# EAGLE design PiHatMotorController (EAGLE 9.6.0)
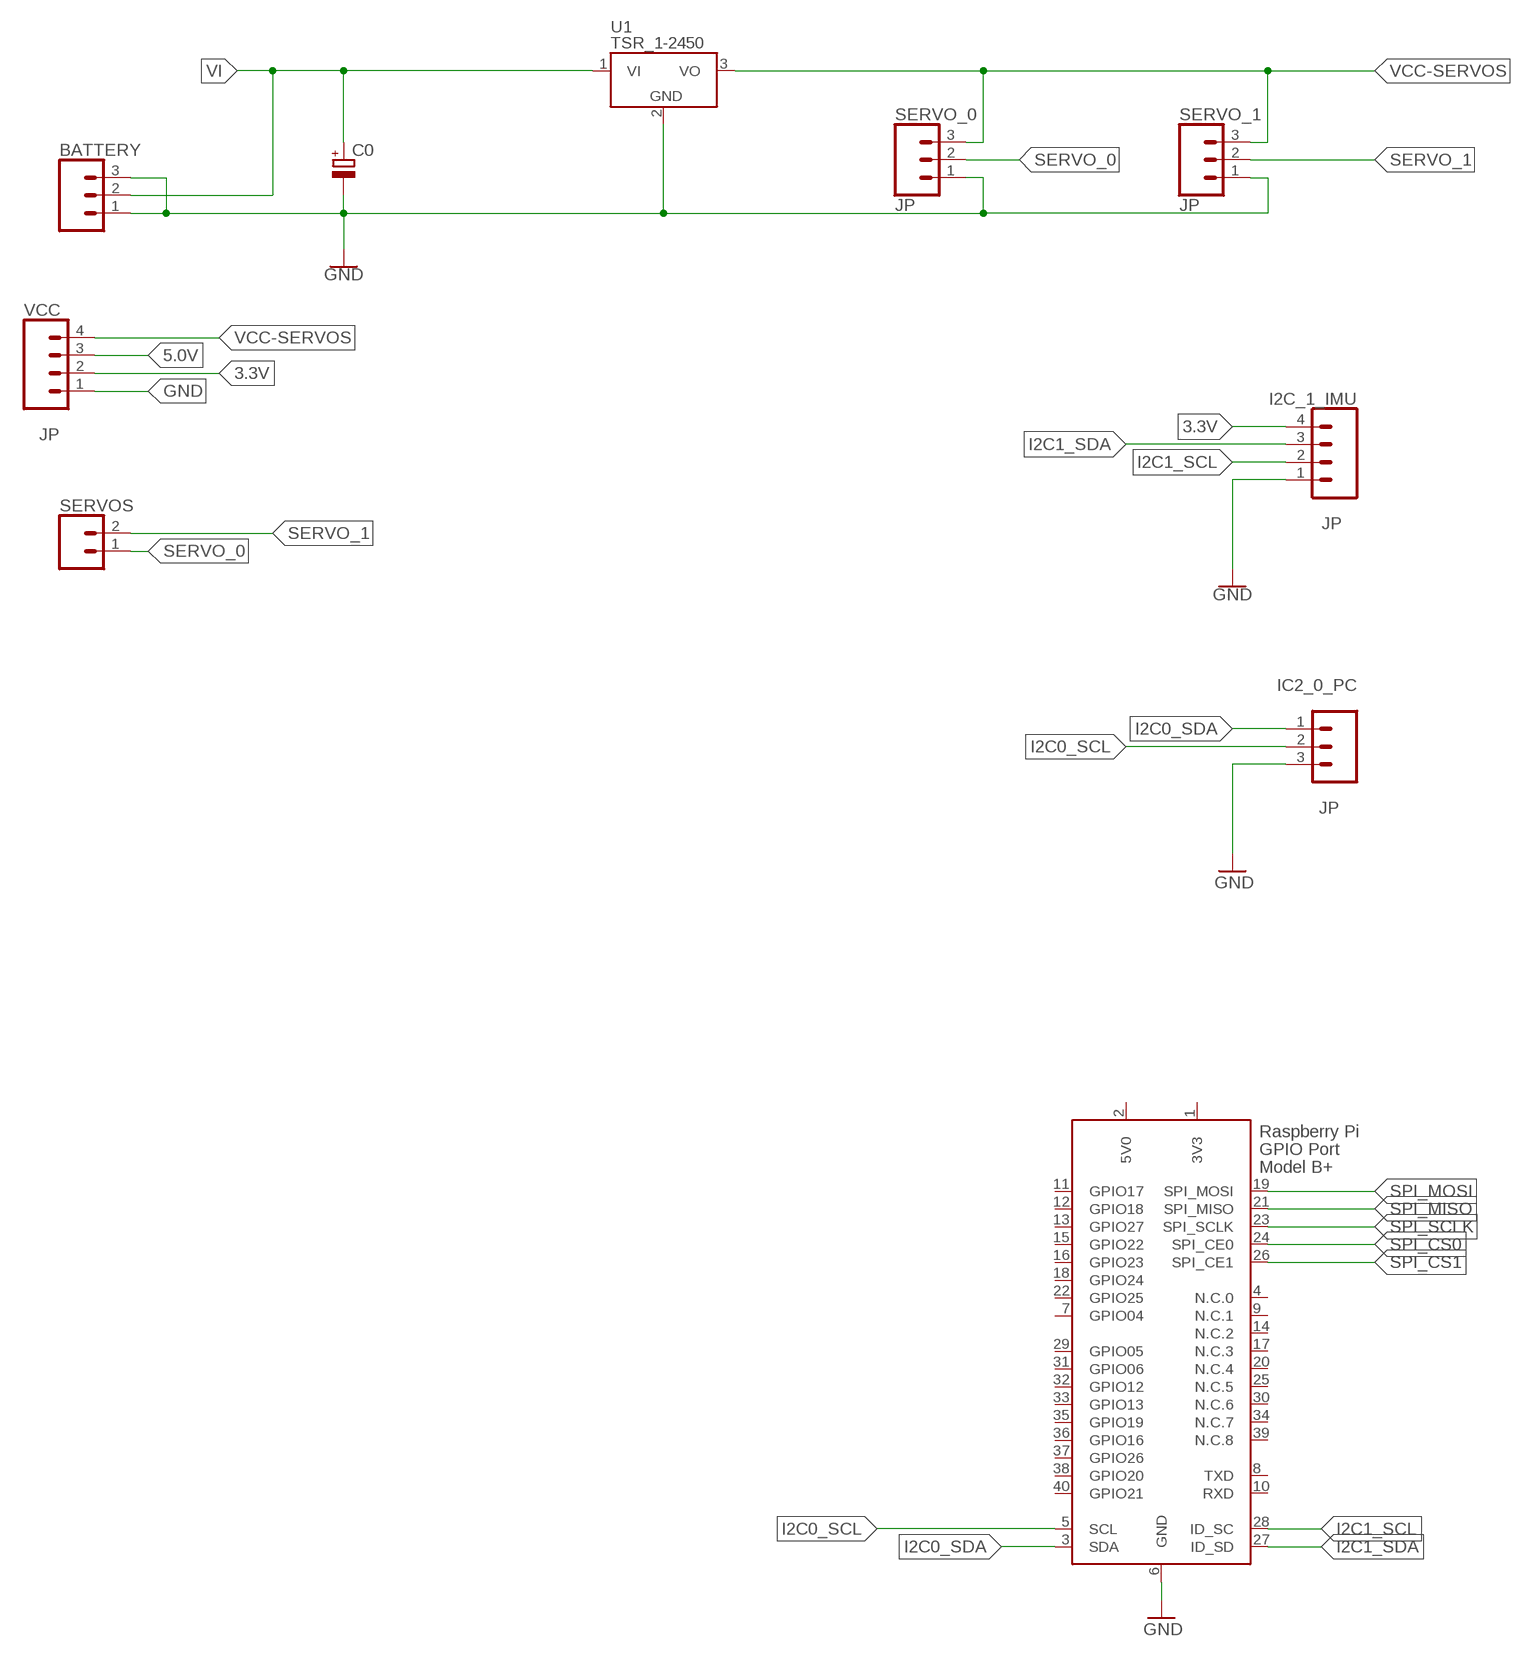
[diagram p0: schematic, sheet 1, part 1 of 2]
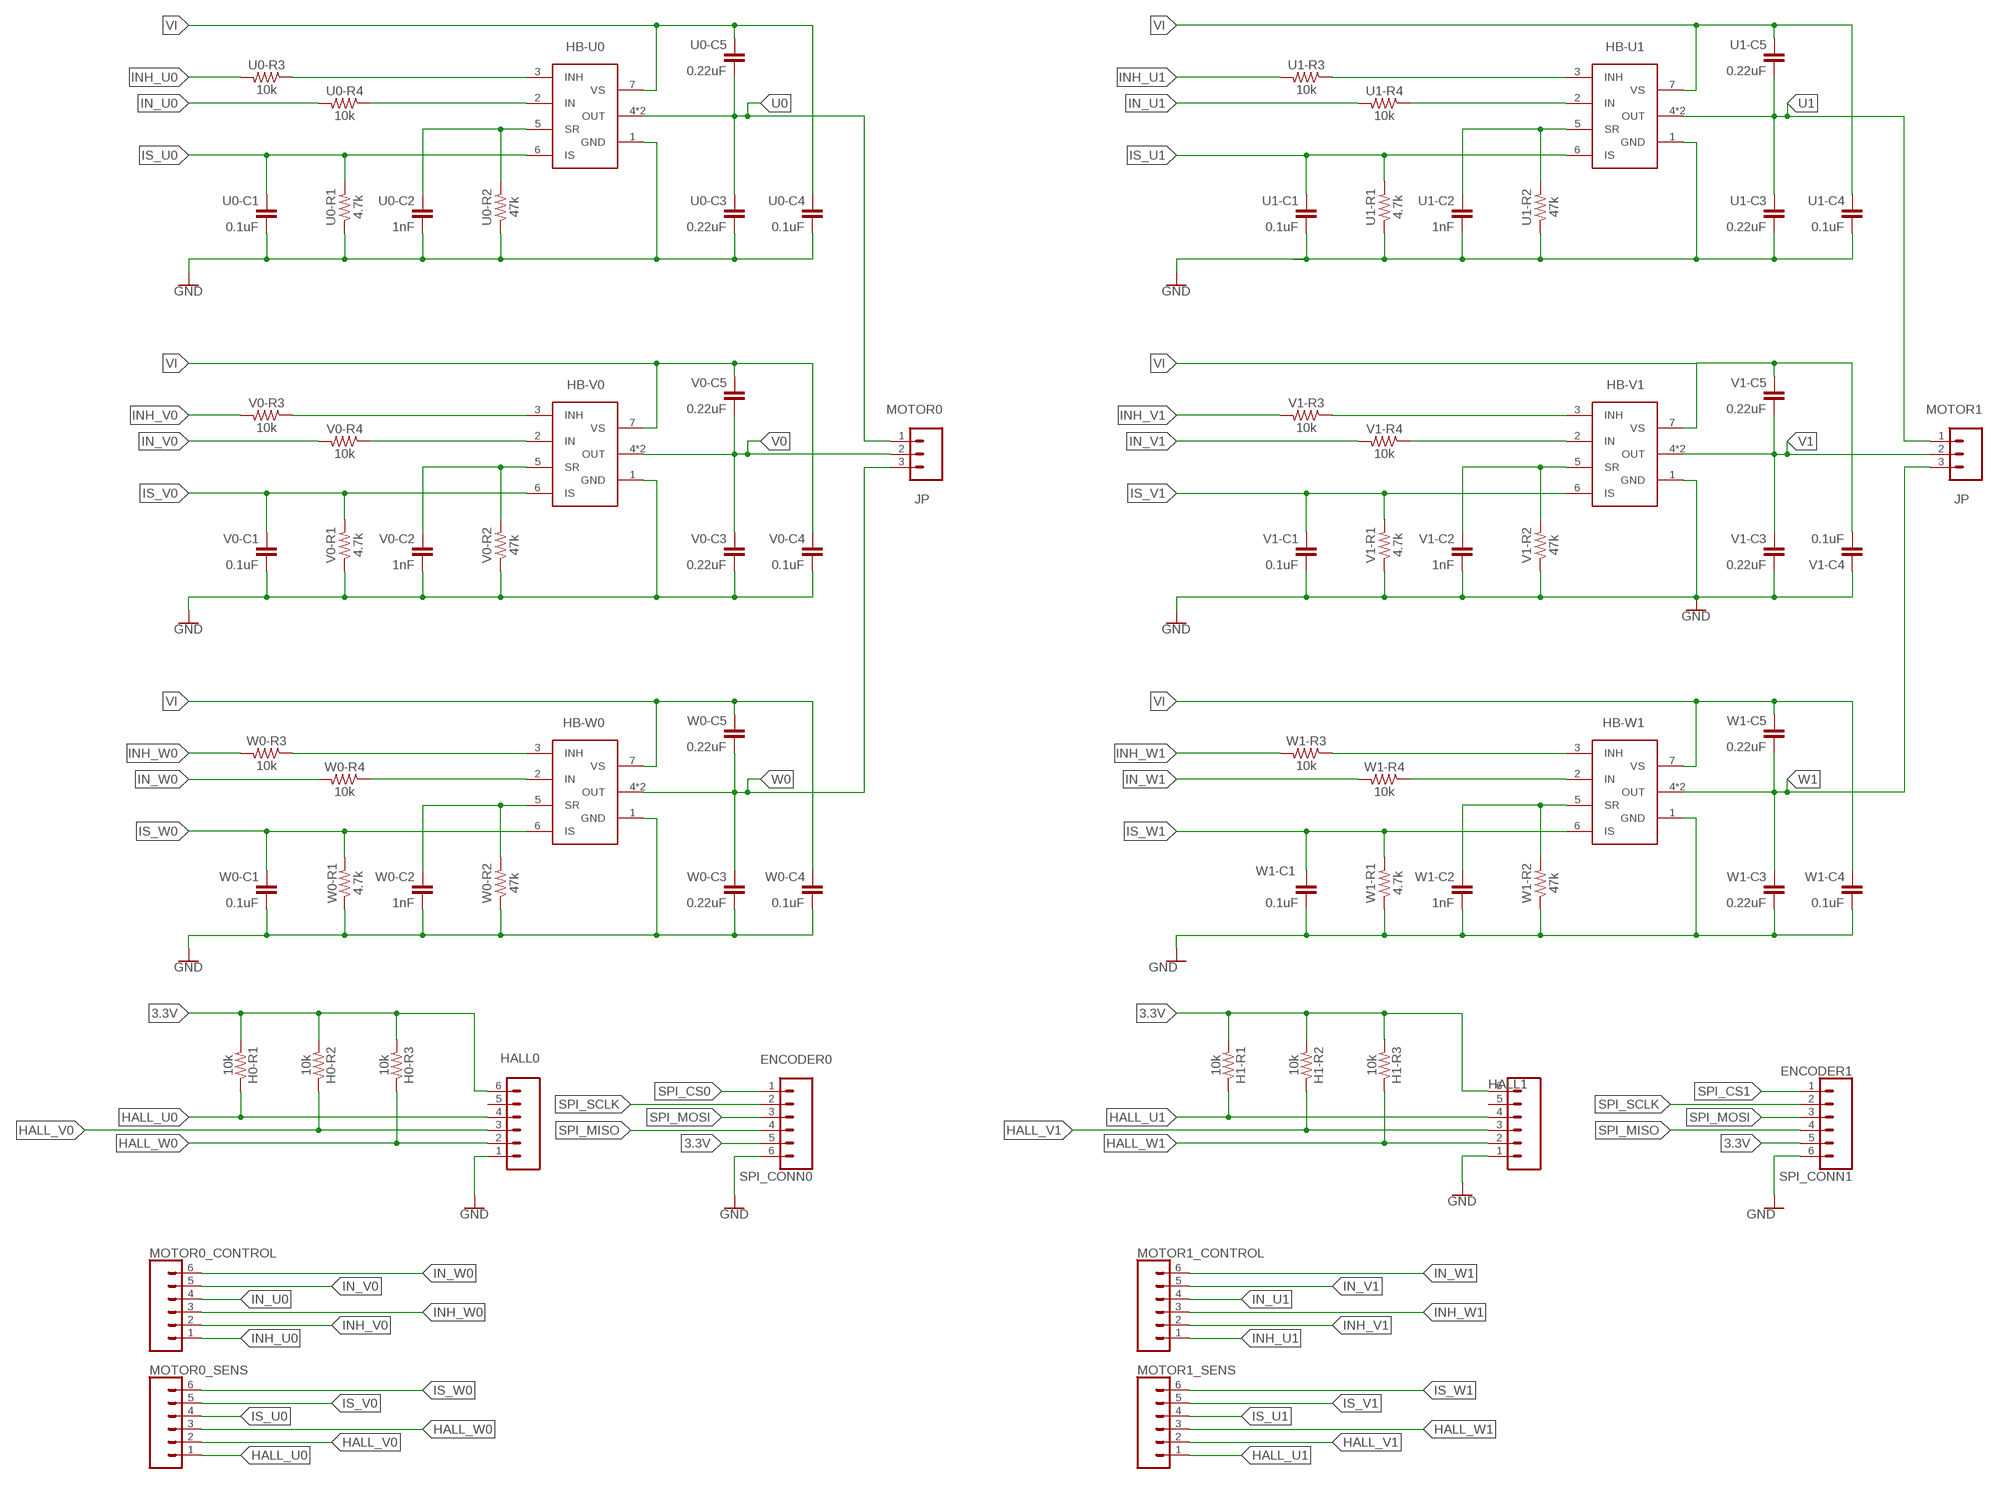
[diagram p1: schematic, sheet 1, part 2 of 2]

## Parts
BATTERY  CONN_031X03_NO_SILK  [1X03_NO_SILK]
C0  CPOL-EUE2,5-6E  [E2,5-6E]
H0-R1  10k  10KOHM-0603-1/10W-1%  [0603]
H0-R2  10k  10KOHM-0603-1/10W-1%  [0603]
H0-R3  10k  10KOHM-0603-1/10W-1%  [0603]
H1-R1  10k  10KOHM-0603-1/10W-1%  [0603]
H1-R2  10k  10KOHM-0603-1/10W-1%  [0603]
H1-R3  10k  10KOHM-0603-1/10W-1%  [0603]
HALL0  CONN_06SMD-1MM  [1X06-1MM]
HALL1  CONN_06SMD-1MM  [1X06-1MM]
HB-U0  IFX007TZZZZ  [P-TO263-7-1]
HB-U1  IFX007TZZZZ  [P-TO263-7-1]
HB-V0  IFX007TZZZZ  [P-TO263-7-1]
HB-V1  IFX007TZZZZ  [P-TO263-7-1]
HB-W0  IFX007TZZZZ  [P-TO263-7-1]
HB-W1  IFX007TZZZZ  [P-TO263-7-1]
I2C_1_IMU  JP  CONN_041X04_NO_SILK  [1X04_NO_SILK]
IC2_0_PC  JP  CONN_031X03_NO_SILK  [1X03_NO_SILK]
MOTOR0  JP  CONN_031X03_NO_SILK  [1X03_NO_SILK]
MOTOR0_CONTROL  CONN_06NO_SILK_NO_POP  [1X06_NO_SILK]
MOTOR0_SENS  CONN_06NO_SILK_NO_POP  [1X06_NO_SILK]
MOTOR1  JP  CONN_031X03_NO_SILK  [1X03_NO_SILK]
MOTOR1_CONTROL  CONN_06NO_SILK_NO_POP  [1X06_NO_SILK]
MOTOR1_SENS  CONN_06NO_SILK_NO_POP  [1X06_NO_SILK]
SERVO_0  JP  CONN_031X03_NO_SILK  [1X03_NO_SILK]
SERVO_1  JP  CONN_031X03_NO_SILK  [1X03_NO_SILK]
SERVOS  CONN_021X02_NO_SILK  [1X02_NO_SILK]
SPI_CONN0  ENCODER0  CONN_06SMD-1MM  [1X06-1MM]
SPI_CONN1  ENCODER1  CONN_06SMD-1MM  [1X06-1MM]
U0-C1  0.1uF  0.1UF-0603-25V-5%  [0603]
U0-C2  1nF  1.0NF/1000PF-0603-50V-10%  [0603]
U0-C3  0.22uF  0.22UF-0603-25V-10%  [0603]
U0-C4  0.1uF  0.1UF-0603-25V-5%  [0603]
U0-C5  0.22uF  0.22UF-0603-25V-10%  [0603]
U0-R1  4.7k  4.7KOHM-0603-1/10W-1%  [0603]
U0-R2  47k  47KOHM-0603-1/10W-1%  [0603]
U0-R3  10k  10KOHM-0603-1/10W-1%  [0603]
U0-R4  10k  10KOHM-0603-1/10W-1%  [0603]
U1  TSR_1-2450  [TSR-1]
U1-C1  0.1uF  0.1UF-0603-25V-5%  [0603]
U1-C2  1nF  1.0NF/1000PF-0603-50V-10%  [0603]
U1-C3  0.22uF  0.22UF-0603-25V-10%  [0603]
U1-C4  0.1uF  0.1UF-0603-25V-5%  [0603]
U1-C5  0.22uF  0.22UF-0603-25V-10%  [0603]
U1-R1  4.7k  4.7KOHM-0603-1/10W-1%  [0603]
U1-R2  47k  47KOHM-0603-1/10W-1%  [0603]
U1-R3  10k  10KOHM-0603-1/10W-1%  [0603]
U1-R4  10k  10KOHM-0603-1/10W-1%  [0603]
V0-C1  0.1uF  0.1UF-0603-25V-5%  [0603]
V0-C2  1nF  1.0NF/1000PF-0603-50V-10%  [0603]
V0-C3  0.22uF  0.22UF-0603-25V-10%  [0603]
V0-C4  0.1uF  0.1UF-0603-25V-5%  [0603]
V0-C5  0.22uF  0.22UF-0603-25V-10%  [0603]
V0-R1  4.7k  4.7KOHM-0603-1/10W-1%  [0603]
V0-R2  47k  47KOHM-0603-1/10W-1%  [0603]
V0-R3  10k  10KOHM-0603-1/10W-1%  [0603]
V0-R4  10k  10KOHM-0603-1/10W-1%  [0603]
V1-C1  0.1uF  0.1UF-0603-25V-5%  [0603]
V1-C2  1nF  1.0NF/1000PF-0603-50V-10%  [0603]
V1-C3  0.22uF  0.22UF-0603-25V-10%  [0603]
V1-C4  0.1uF  0.1UF-0603-25V-5%  [0603]
V1-C5  0.22uF  0.22UF-0603-25V-10%  [0603]
V1-R1  4.7k  4.7KOHM-0603-1/10W-1%  [0603]
V1-R2  47k  47KOHM-0603-1/10W-1%  [0603]
V1-R3  10k  10KOHM-0603-1/10W-1%  [0603]
V1-R4  10k  10KOHM-0603-1/10W-1%  [0603]
VCC  JP  CONN_041X04_NO_SILK  [1X04_NO_SILK]
W0-C1  0.1uF  0.1UF-0603-25V-5%  [0603]
W0-C2  1nF  1.0NF/1000PF-0603-50V-10%  [0603]
W0-C3  0.22uF  0.22UF-0603-25V-10%  [0603]
W0-C4  0.1uF  0.1UF-0603-25V-5%  [0603]
W0-C5  0.22uF  0.22UF-0603-25V-10%  [0603]
W0-R1  4.7k  4.7KOHM-0603-1/10W-1%  [0603]
W0-R2  47k  47KOHM-0603-1/10W-1%  [0603]
W0-R3  10k  10KOHM-0603-1/10W-1%  [0603]
W0-R4  10k  10KOHM-0603-1/10W-1%  [0603]
W1-C1  0.1uF  0.1UF-0603-25V-5%  [0603]
W1-C2  1nF  1.0NF/1000PF-0603-50V-10%  [0603]
W1-C3  0.22uF  0.22UF-0603-25V-10%  [0603]
W1-C4  0.1uF  0.1UF-0603-25V-5%  [0603]
W1-C5  0.22uF  0.22UF-0603-25V-10%  [0603]
W1-R1  4.7k  4.7KOHM-0603-1/10W-1%  [0603]
W1-R2  47k  47KOHM-0603-1/10W-1%  [0603]
W1-R3  10k  10KOHM-0603-1/10W-1%  [0603]
W1-R4  10k  10KOHM-0603-1/10W-1%  [0603]
X1  RASPI_BOARD_B+_H  [RASPI_BOARD_B+HAT]

## Nets
3.3V: H0-R1.2 H0-R2.2 H0-R3.2 H1-R1.2 H1-R2.2 H1-R3.2 HALL0.6 HALL1.6 I2C_1_IMU.4 SPI_CONN0.5 SPI_CONN1.5 VCC.2
5.0V: VCC.3
GND: BATTERY.1 BATTERY.3 C0.- HALL0.1 HALL1.1 HB-U0.1(GND) HB-U1.1(GND) HB-V0.1(GND) HB-V1.1(GND) HB-W0.1(GND) HB-W1.1(GND) I2C_1_IMU.1 IC2_0_PC.3 SERVO_0.1 SERVO_1.1 SPI_CONN0.6 SPI_CONN1.6 U0-C1.1 U0-C2.1 U0-C3.1 U0-C4.1 U0-R1.1 U0-R2.1 U1-C1.1 U1-C2.1 U1-C3.1 U1-C4.1 U1-R1.1 U1-R2.1 U1.2(GND) V0-C1.1 V0-C2.1 V0-C3.1 V0-C4.1 V0-R1.1 V0-R2.1 V1-C1.1 V1-C2.1 V1-C3.1 V1-C4.1 V1-R1.1 V1-R2.1 VCC.1 W0-C1.1 W0-C2.1 W0-C3.1 W0-C4.1 W0-R1.1 W0-R2.1 W1-C1.1 W1-C2.1 W1-C3.1 W1-C4.1 W1-R1.1 W1-R2.1 X1.6(GND)
HALL_U0: H0-R1.1 HALL0.4 MOTOR0_SENS.1
HALL_U1: H1-R1.1 HALL1.4 MOTOR1_SENS.1
HALL_V0: H0-R2.1 HALL0.3 MOTOR0_SENS.2
HALL_V1: H1-R2.1 HALL1.3 MOTOR1_SENS.2
HALL_W0: H0-R3.1 HALL0.2 MOTOR0_SENS.3
HALL_W1: H1-R3.1 HALL1.2 MOTOR1_SENS.3
HB_IN_U0: HB-U0.2(IN) U0-R4.1
HB_IN_U1: HB-U1.2(IN) U1-R4.1
HB_IN_V0: HB-V0.2(IN) V0-R4.1
HB_IN_V1: HB-V1.2(IN) V1-R4.1
HB_IN_W0: HB-W0.2(IN) W0-R4.1
HB_IN_W1: HB-W1.2(IN) W1-R4.1
HB_INH_U0: HB-U0.3(INH) U0-R3.1
HB_INH_U1: HB-U1.3(INH) U1-R3.1
HB_INH_V0: HB-V0.3(INH) V0-R3.1
HB_INH_V1: HB-V1.3(INH) V1-R3.1
HB_INH_W0: HB-W0.3(INH) W0-R3.1
HB_INH_W1: HB-W1.3(INH) W1-R3.1
I2C0_SCL: IC2_0_PC.2 X1.5(SCL)
I2C0_SDA: IC2_0_PC.1 X1.3(SDA)
I2C1_SCL: I2C_1_IMU.2 X1.28(ID_SC)
I2C1_SDA: I2C_1_IMU.3 X1.27(ID_SD)
IN_U0: MOTOR0_CONTROL.4 U0-R4.2
IN_U1: MOTOR1_CONTROL.4 U1-R4.2
IN_V0: MOTOR0_CONTROL.5 V0-R4.2
IN_V1: MOTOR1_CONTROL.5 V1-R4.2
IN_W0: MOTOR0_CONTROL.6 W0-R4.2
IN_W1: MOTOR1_CONTROL.6 W1-R4.2
INH_U0: MOTOR0_CONTROL.1 U0-R3.2
INH_U1: MOTOR1_CONTROL.1 U1-R3.2
INH_V0: MOTOR0_CONTROL.2 V0-R3.2
INH_V1: MOTOR1_CONTROL.2 V1-R3.2
INH_W0: MOTOR0_CONTROL.3 W0-R3.2
INH_W1: MOTOR1_CONTROL.3 W1-R3.2
IS_U0: HB-U0.6(IS) MOTOR0_SENS.4 U0-C1.2 U0-R1.2
IS_U1: HB-U1.6(IS) MOTOR1_SENS.4 U1-C1.2 U1-R1.2
IS_V0: HB-V0.6(IS) MOTOR0_SENS.5 V0-C1.2 V0-R1.2
IS_V1: HB-V1.6(IS) MOTOR1_SENS.5 V1-C1.2 V1-R1.2
IS_W0: HB-W0.6(IS) MOTOR0_SENS.6 W0-C1.2 W0-R1.2
IS_W1: HB-W1.6(IS) MOTOR1_SENS.6 W1-C1.2 W1-R1.2
SERVO_0: SERVO_0.2 SERVOS.1
SERVO_1: SERVO_1.2 SERVOS.2
SPI_CS0: SPI_CONN0.1 X1.24(SPI_CE0)
SPI_CS1: SPI_CONN1.1 X1.26(SPI_CE1)
SPI_MISO: SPI_CONN0.4 SPI_CONN1.4 X1.21(SPI_MISO)
SPI_MOSI: SPI_CONN0.3 SPI_CONN1.3 X1.19(SPI_MOSI)
SPI_SCLK: SPI_CONN0.2 SPI_CONN1.2 X1.23(SPI_SCLK)
SR_U0: HB-U0.5(SR) U0-C2.2 U0-R2.2
SR_U1: HB-U1.5(SR) U1-C2.2 U1-R2.2
SR_V0: HB-V0.5(SR) V0-C2.2 V0-R2.2
SR_V1: HB-V1.5(SR) V1-C2.2 V1-R2.2
SR_W0: HB-W0.5(SR) W0-C2.2 W0-R2.2
SR_W1: HB-W1.5(SR) W1-C2.2 W1-R2.2
U0: HB-U0.4(OUT) HB-U0.8(OUT) MOTOR0.1 U0-C3.2 U0-C5.2
U1: HB-U1.4(OUT) HB-U1.8(OUT) MOTOR1.1 U1-C3.2 U1-C5.2
V0: HB-V0.4(OUT) HB-V0.8(OUT) MOTOR0.2 V0-C3.2 V0-C5.2
V1: HB-V1.4(OUT) HB-V1.8(OUT) MOTOR1.2 V1-C3.2 V1-C5.2
VCC-SERVOS: SERVO_0.3 SERVO_1.3 U1.3(VO) VCC.4
VI: BATTERY.2 C0.+ HB-U0.7(VS) HB-U1.7(VS) HB-V0.7(VS) HB-V1.7(VS) HB-W0.7(VS) HB-W1.7(VS) U0-C4.2 U0-C5.1 U1-C4.2 U1-C5.1 U1.1(VI) V0-C4.2 V0-C5.1 V1-C4.2 V1-C5.1 W0-C4.2 W0-C5.1 W1-C4.2 W1-C5.1
W0: HB-W0.4(OUT) HB-W0.8(OUT) MOTOR0.3 W0-C3.2 W0-C5.2
W1: HB-W1.4(OUT) HB-W1.8(OUT) MOTOR1.3 W1-C3.2 W1-C5.2
Unconnected: HALL0.5 HALL1.5 X1.4(N.C.0) X1.7(GPIO04) X1.8(TXD) X1.9(N.C.1) X1.10(RXD) X1.11(GPIO17) X1.12(GPIO18) X1.13(GPIO27) X1.14(N.C.2) X1.15(GPIO22) X1.16(GPIO23) X1.17(N.C.3) X1.18(GPIO24) X1.20(N.C.4) X1.22(GPIO25) X1.25(N.C.5) X1.29(GPIO05) X1.30(N.C.6) X1.31(GPIO06) X1.32(GPIO12) X1.33(GPIO13) X1.34(N.C.7) X1.35(GPIO19) X1.36(GPIO16) X1.37(GPIO26) X1.38(GPIO20) X1.39(N.C.8) X1.40(GPIO21)

## Power pins joined to a net without a drawn wire
3V3: X1.1(3V3)
5V0: X1.2(5V0)

## Library data of the parts
BATTERY IC2_0_PC MOTOR0 MOTOR1 SERVO_0 SERVO_1 = SparkFun-Connectors:CONN_03: Multi connection point. Often used as Generic Header-pin footprint for 0.1 inch spaced/style header connections On any of the 0.1 inch spaced packages, you can populate with these: Break Away Headers - Straight <https://www.sparkfun.com/products/116> (PRT-00116) Break Away Male Headers - Right Angle <https://www.sparkfun.com/products/553> (PRT-00553) Female Headers <https://www.sparkfun.com/products/115> (PRT-00115) Break Away Headers - Machine Pin <https://www.sparkfun.com/products/117> (PRT-00117) Break Away Female Headers - Swiss Machine Pin <https://www.sparkfun.com/products/743> (PRT-00743) Stackable Header - 3 Pin (Female, 0.1") <https://www.sparkfun.com/products/13875> (PRT-13875) For SCREWTERMINALS and SPRING TERMINALS visit here: Screw Terimnals on SparkFun.com <https://www.sparkfun.com/search/results?term=Screw+Terminals> (5mm/3.5mm/2.54mm spacing) This device is also useful as a general connection point to wire up your design to another part of your project. Our various solder wires solder well into these plated through hole pads. Hook-Up Wire - Assortment (Stranded, 22 AWG) <https://www.sparkfun.com/products/11375> (PRT-11375) Hook-Up Wire - Assortment (Solid Core, 22 AWG) <https://www.sparkfun.com/products/11367> (PRT-11367) View the entire wire category on our website here <https://www.sparkfun.com/categories/141> Special notes: Molex polarized connector foot print use with SKU : PRT-08232 with associated crimp pins and housings.
C0 = rcl:CPOL-EU: POLARIZED CAPACITOR, European symbol; SPICEPREFIX: C
H0-R1-H0-R3 H1-R1-H1-R3 U0-R3 U0-R4 U1-R3 U1-R4 V0-R3 V0-R4 V1-R3 V1-R4 W0-R3 W0-R4 W1-R3 W1-R4 = SparkFun-Resistors:10KOHM: 10kΩ resistor A resistor is a passive two-terminal electrical component that implements electrical resistance as a circuit element. Resistors act to reduce current flow, and, at the same time, act to lower voltage levels within circuits. - Wikipedia; PROD_ID: RES-00824
HALL0 HALL1 SPI_CONN0 SPI_CONN1 = SparkFun-Connectors:CONN_06: Multi connection point. Often used as Generic Header-pin footprint for 0.1 inch spaced/style header connections On any of the 0.1 inch spaced packages, you can populate with these: Break Away Headers - Straight <https://www.sparkfun.com/products/116> (PRT-00116) Break Away Male Headers - Right Angle <https://www.sparkfun.com/products/553> (PRT-00553) Female Headers <https://www.sparkfun.com/products/115> (PRT-00115) Break Away Headers - Machine Pin <https://www.sparkfun.com/products/117> (PRT-00117) Break Away Female Headers - Swiss Machine Pin <https://www.sparkfun.com/products/743> (PRT-00743) Arduino Stackable Header - 6 Pin <https://www.sparkfun.com/products/9280> (PRT-09280) For SCREWTERMINALS and SPRING TERMINALS visit here: Screw Terimnals on SparkFun.com <https://www.sparkfun.com/search/results?term=Screw+Terminals> (5mm/3.5mm/2.54mm spacing) This device is also useful as a general connection point to wire up your design to another part of your project. Our various solder wires solder well into these plated through hole pads. Hook-Up Wire - Assortment (Stranded, 22 AWG) <https://www.sparkfun.com/products/11375> (PRT-11375) Hook-Up Wire - Assortment (Solid Core, 22 AWG) <https://www.sparkfun.com/products/11367> (PRT-11367) View the entire wire category on our website here <https://www.sparkfun.com/categories/141>; PROD_ID: CONN-08249; SF_ID: GPS-00579
HB-U0 HB-U1 HB-V0 HB-V1 HB-W0 HB-W1 = ITX007T:IFX007T
I2C_1_IMU VCC = SparkFun-Connectors:CONN_04: Multi connection point. Often used as Generic Header-pin footprint for 0.1 inch spaced/style header connections On any of the 0.1 inch spaced packages, you can populate with these: Break Away Headers - Straight <https://www.sparkfun.com/products/116> (PRT-00116) Break Away Male Headers - Right Angle <https://www.sparkfun.com/products/553> (PRT-00553) Female Headers <https://www.sparkfun.com/products/115> (PRT-00115) Break Away Headers - Machine Pin <https://www.sparkfun.com/products/117> (PRT-00117) Break Away Female Headers - Swiss Machine Pin <https://www.sparkfun.com/products/743> (PRT-00743) For SCREWTERMINALS and SPRING TERMINALS visit here: Screw Terimnals on SparkFun.com <https://www.sparkfun.com/search/results?term=Screw+Terminals> (5mm/3.5mm/2.54mm spacing) This device is also useful as a general connection point to wire up your design to another part of your project. Our various solder wires solder well into these plated through hole pads. Hook-Up Wire - Assortment (Stranded, 22 AWG) <https://www.sparkfun.com/products/11375> (PRT-11375) Hook-Up Wire - Assortment (Solid Core, 22 AWG) <https://www.sparkfun.com/products/11367> (PRT-11367) View the entire wire category on our website here <https://www.sparkfun.com/categories/141> Special notes: Molex polarized connector foot print use with SKU : PRT-08231 with associated crimp pins and housings. 1MM SMD Version SKU: PRT-10208; PROD_ID: CONN-09696
MOTOR0_CONTROL MOTOR0_SENS MOTOR1_CONTROL MOTOR1_SENS = SparkFun-Connectors:CONN_06: Multi connection point. Often used as Generic Header-pin footprint for 0.1 inch spaced/style header connections On any of the 0.1 inch spaced packages, you can populate with these: Break Away Headers - Straight <https://www.sparkfun.com/products/116> (PRT-00116) Break Away Male Headers - Right Angle <https://www.sparkfun.com/products/553> (PRT-00553) Female Headers <https://www.sparkfun.com/products/115> (PRT-00115) Break Away Headers - Machine Pin <https://www.sparkfun.com/products/117> (PRT-00117) Break Away Female Headers - Swiss Machine Pin <https://www.sparkfun.com/products/743> (PRT-00743) Arduino Stackable Header - 6 Pin <https://www.sparkfun.com/products/9280> (PRT-09280) For SCREWTERMINALS and SPRING TERMINALS visit here: Screw Terimnals on SparkFun.com <https://www.sparkfun.com/search/results?term=Screw+Terminals> (5mm/3.5mm/2.54mm spacing) This device is also useful as a general connection point to wire up your design to another part of your project. Our various solder wires solder well into these plated through hole pads. Hook-Up Wire - Assortment (Stranded, 22 AWG) <https://www.sparkfun.com/products/11375> (PRT-11375) Hook-Up Wire - Assortment (Solid Core, 22 AWG) <https://www.sparkfun.com/products/11367> (PRT-11367) View the entire wire category on our website here <https://www.sparkfun.com/categories/141>
SERVOS = SparkFun-Connectors:CONN_02: Multi connection point. Often used as Generic Header-pin footprint for 0.1 inch spaced/style header connections On any of the 0.1 inch spaced packages, you can populate with these: Break Away Headers - Straight <https://www.sparkfun.com/products/116> (PRT-00116) Break Away Male Headers - Right Angle <https://www.sparkfun.com/products/553> (PRT-00553) Female Headers <https://www.sparkfun.com/products/115> (PRT-00115) Break Away Headers - Machine Pin <https://www.sparkfun.com/products/117> (PRT-00117) Break Away Female Headers - Swiss Machine Pin <https://www.sparkfun.com/products/743> (PRT-00743) For SCREWTERMINALS and SPRING TERMINALS visit here: Screw Terimnals on SparkFun.com <https://www.sparkfun.com/search/results?term=Screw+Terminals> (5mm/3.5mm/2.54mm spacing) This device is also useful as a general connection point to wire up your design to another part of your project. Our various solder wires solder well into these plated through hole pads. Hook-Up Wire - Assortment (Stranded, 22 AWG) <https://www.sparkfun.com/products/11375> (PRT-11375) Hook-Up Wire - Assortment (Solid Core, 22 AWG) <https://www.sparkfun.com/products/11367> (PRT-11367) View the entire wire category on our website here <https://www.sparkfun.com/categories/141> Special notes: Molex polarized connector foot print use with: PRT-08233 with associated crimp pins and housings. 2.54_SCREWTERM for use with PRT-10571. 3.5mm Screw Terminal footprints for PRT-08084 5mm Screw Terminal footprints for use with PRT-08432
U0-C1 U0-C4 U1-C1 U1-C4 V0-C1 V0-C4 V1-C1 V1-C4 W0-C1 W0-C4 W1-C1 W1-C4 = SparkFun-Capacitors:0.1UF: 0.1µF ceramic capacitors A capacitor is a passive two-terminal electrical component used to store electrical energy temporarily in an electric field.; PROD_ID: CAP-08604
U0-C2 U1-C2 V0-C2 V1-C2 W0-C2 W1-C2 = SparkFun-Capacitors:1.0NF/1000PF: 1nF/1,000pF ceramic capacitors A capacitor is a passive two-terminal electrical component used to store electrical energy temporarily in an electric field.; PROD_ID: CAP-07886
U0-C3 U0-C5 U1-C3 U1-C5 V0-C3 V0-C5 V1-C3 V1-C5 W0-C3 W0-C5 W1-C3 W1-C5 = SparkFun-Capacitors:0.22UF: 0.22µF ceramic capacitors A capacitor is a passive two-terminal electrical component used to store electrical energy temporarily in an electric field.; PROD_ID: CAP-07822
U0-R1 U1-R1 V0-R1 V1-R1 W0-R1 W1-R1 = SparkFun-Resistors:4.7KOHM: 4.7kΩ resistor A resistor is a passive two-terminal electrical component that implements electrical resistance as a circuit element. Resistors act to reduce current flow, and, at the same time, act to lower voltage levels within circuits. - Wikipedia; PROD_ID: RES-07857
U0-R2 U1-R2 V0-R2 V1-R2 W0-R2 W1-R2 = SparkFun-Resistors:47KOHM: 47kΩ resistor A resistor is a passive two-terminal electrical component that implements electrical resistance as a circuit element. Resistors act to reduce current flow, and, at the same time, act to lower voltage levels within circuits. - Wikipedia; PROD_ID: RES-07871
U1 = _traco_tsr-1:TSR_1-*: TRACO TSR-1 Series Point-of-Load DC/DC-Converters Vi max. 36 V; Vo = (1.2 .. 15)V ±2%; Io = 0 .. 1 A SIP-Package (drop-in replacement for 78xx linear voltage regulators in TO220-package, vertically assembled) Source: www.tracopower.com Technologies: TSR 1- Vi (V) Vo (V) ±2% Io = 0 .. 1 A 24_ ( generic ) 2412 4.6 .. 36 1.2 2415 4.6 .. 36 1.5 2418 4.6 .. 36 1.8 2425 4.6 .. 36 2.5 2433 4.75.. 36 3.3 2450 6.5 .. 36 5.0 2465 9.0 .. 36 6.5 2490 12 .. 36 9.0 24120 15 .. 36 12 24150 18 .. 36 15 Author: Dipl.-Ing. FH Rainer Bayer HHN Hochschule Heilbronn, rainer.bayer@hs-heilbronn.de Ingenieurbüro ing-rb, mail@ing-rb.de
X1 = raspberrypi_bastelstube_v13:RASPI_BOARD_B+: Raspberry Pi GPIO connector with markings for the outer dimensions of the Raspberry Pi board model B+ with different sets of drill holes or mounting pads

## Net classes
0 default: width 0.305 mm

## Board
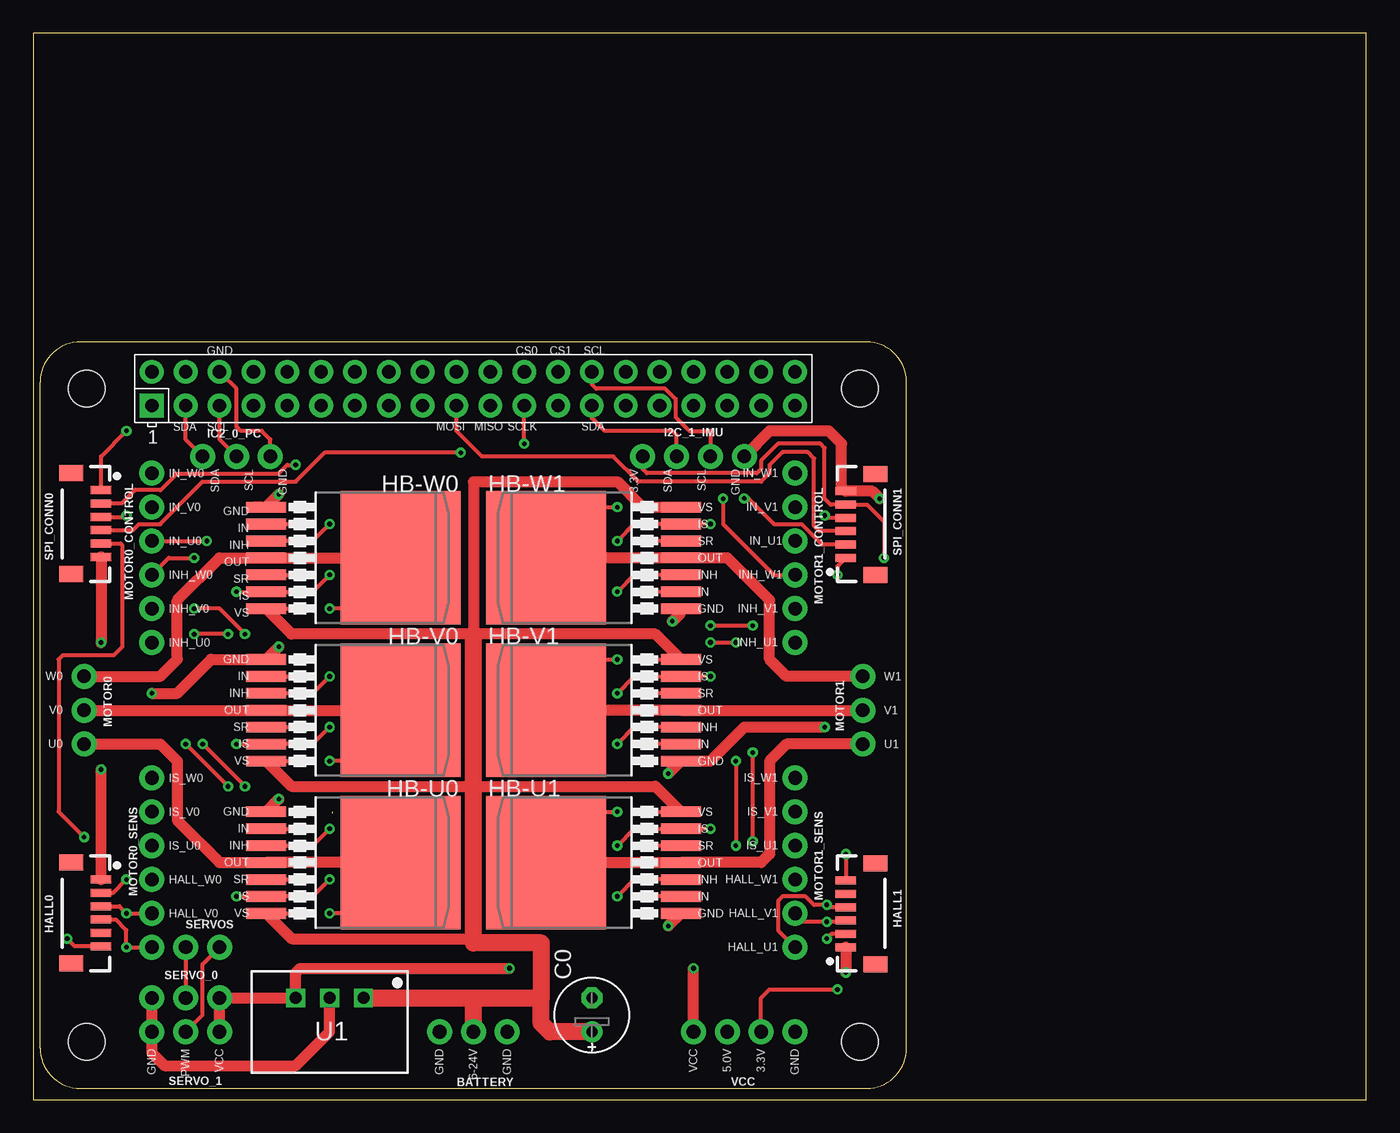
[diagram p2: board, top side]
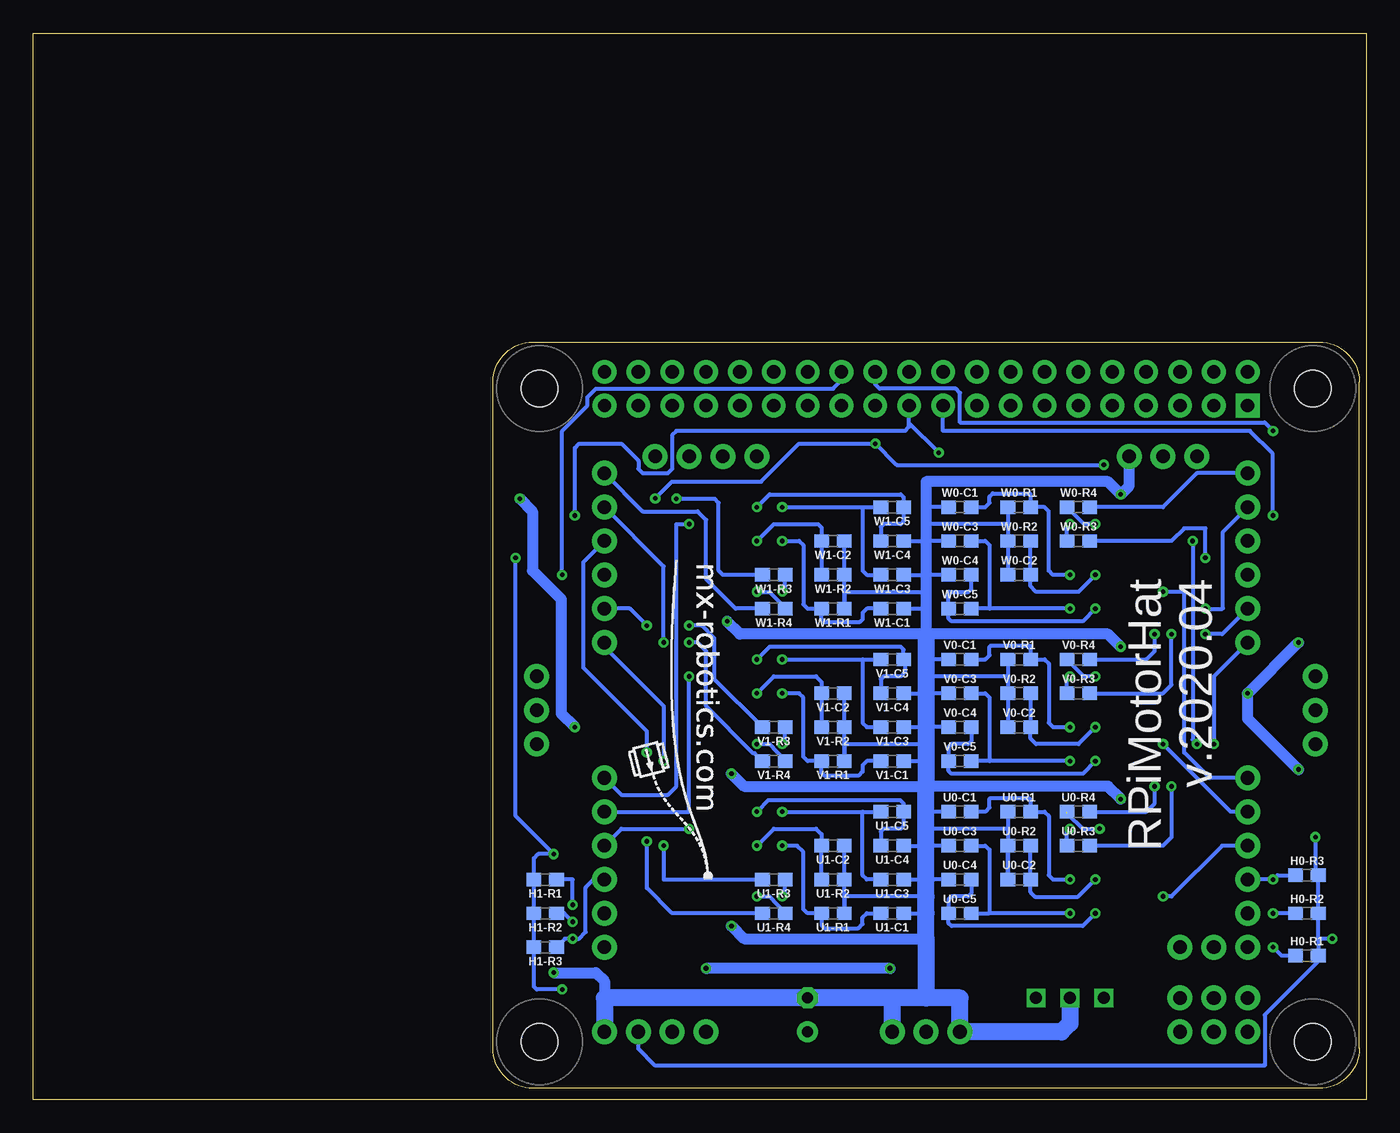
[diagram p3: board, bottom side, seen from below]

Size 100 x 80 mm. Coordinates in mm from the lower left corner, seen from the top.
Outline: 0,0 100,0 100,80 0,80 0,0
Copper layers (1*16): Top 0.035mm / dielectric 1.5mm / Bottom 0.035mm
Design rules "default": minimum track width 6mil, minimum drill 0.35mm, track to track 6mil, track to pad 6mil, pad to pad 6mil, via to via 6mil, smd to smd 6mil, copper to edge 40mil, drill to drill 6mil, minimum pad ring 10mil, minimum via ring 8mil, stop-mask expansion 4mil, vias tented up to drill 0mil, thermal gap 10mil

### Footprints (pad centres in the part's own frame; a part is rotated, then mirrored left to right if it is on the bottom)
1X03_NO_SILK = drill 1.016 pad 1.88: 1 0,0; 2 2.54,0; 3 5.08,0
E2,5-6E = drill 0.813 pad 1.575: + -1.27,0 | drill 0.813 pad 1.575 octagon: - 1.27,0
0603 = smd 1.1 x 1: 1 -0.85,0; 2 0.85,0
1X06-1MM = smd 0.6 x 1.55: 1 -2.54,1.27; 2 -1.54,1.27; 3 -0.54,1.27; 4 0.46,1.27; 5 1.46,1.27; 6 2.46,1.27 | smd 1.2 x 1.8: P$1 -3.84,-0.955; P$2 3.76,-0.955
P-TO263-7-1 = smd 0.8 x 3: 1 -3.81,-9.207; 2 -2.54,-9.207; 3 -1.27,-9.207; 4 0,-9.207; 5 1.27,-9.207; 6 2.54,-9.207; 7 3.81,-9.207 | smd 10 x 9: 8 0,0.895
1X04_NO_SILK = drill 1.016 pad 1.88: 1 0,0; 2 2.54,0; 3 5.08,0; 4 7.62,0
1X06_NO_SILK = drill 1.016 pad 1.88: 1 0,0; 2 2.54,0; 3 5.08,0; 4 7.62,0; 5 10.16,0; 6 12.7,0
1X02_NO_SILK = drill 1.016 pad 1.88: 1 0,0; 2 2.54,0
TSR-1 = drill 0.9 square: 1 -2.54,0; 2 0,0; 3 2.54,0
RASPI_BOARD_B+HAT = drill 1 pad 1.778 square: 1 8.37,51.23 | drill 1 pad 1.778: 2 8.37,53.77; 3 10.91,51.23; 4 10.91,53.77; 5 13.45,51.23; 6 13.45,53.77; 7 15.99,51.23; 8 15.99,53.77; 9 18.53,51.23; 10 18.53,53.77; 11 21.07,51.23; 12 21.07,53.77; 13 23.61,51.23; 14 23.61,53.77; 15 26.15,51.23; 16 26.15,53.77; 17 28.69,51.23; 18 28.69,53.77; 19 31.23,51.23; 20 31.23,53.77; 21 33.77,51.23; 22 33.77,53.77; 23 36.31,51.23; 24 36.31,53.77; 25 38.85,51.23; 26 38.85,53.77; 27 41.39,51.23; 28 41.39,53.77; 29 43.93,51.23; 30 43.93,53.77; 31 46.47,51.23; 32 46.47,53.77; 33 49.01,51.23; 34 49.01,53.77; 35 51.55,51.23; 36 51.55,53.77; 37 54.09,51.23; 38 54.09,53.77; 39 56.63,51.23; 40 56.63,53.77 | hole 2.75: 3.5,3.5; 3.5,52.5; 61.5,3.5; 61.5,52.5

### Placement (x,y rotation side)
BATTERY  30.48,5.08 0 top
C0  41.91,6.35 90 top
H0-R1  4.45,10.79 0 bottom
H0-R2  4.45,13.97 0 bottom
H0-R3  4.45,16.83 0 bottom
H1-R1  61.59,16.51 180 bottom
H1-R2  61.59,13.97 180 bottom
H1-R3  61.59,11.43 180 bottom
HALL0  3.81,13.97 270 top
HALL1  62.23,13.97 90 top
HB-U0  26.67,17.78 270 top
HB-U1  39.37,17.78 90 top
HB-V0  26.67,29.21 270 top
HB-V1  39.37,29.21 90 top
HB-W0  26.67,40.64 270 top
HB-W1  39.37,40.64 90 top
I2C_1_IMU  53.34,48.26 180 top
IC2_0_PC  12.7,48.26 0 top
MOTOR0  3.81,26.67 90 top
MOTOR0_CONTROL  8.89,34.29 90 top
MOTOR0_SENS  8.89,11.43 90 top
MOTOR1  62.23,26.67 90 top
MOTOR1_CONTROL  57.15,34.29 90 top
MOTOR1_SENS  57.15,11.43 90 top
SERVO_0  8.89,7.62 0 top
SERVO_1  8.89,5.08 0 top
SERVOS  11.43,11.43 0 top
SPI_CONN0  3.81,43.18 270 top
SPI_CONN1  62.23,43.18 90 top
U0-C1  30.48,21.59 0 bottom
U0-C2  26.04,16.51 0 bottom
U0-C3  30.48,19.05 0 bottom
U0-C4  30.48,16.51 0 bottom
U0-C5  30.48,13.97 0 bottom
U0-R1  26.04,21.59 0 bottom
U0-R2  26.04,19.05 0 bottom
U0-R3  21.59,19.05 0 bottom
U0-R4  21.59,21.59 0 bottom
U1  22.23,7.62 180 top
U1-C1  35.56,13.97 180 bottom
U1-C2  40.01,19.05 180 bottom
U1-C3  35.56,16.51 180 bottom
U1-C4  35.56,19.05 180 bottom
U1-C5  35.56,21.59 180 bottom
U1-R1  40.01,13.97 180 bottom
U1-R2  40.01,16.51 180 bottom
U1-R3  44.45,16.51 180 bottom
U1-R4  44.45,13.97 180 bottom
V0-C1  30.48,33.02 0 bottom
V0-C2  26.04,27.94 0 bottom
V0-C3  30.48,30.48 0 bottom
V0-C4  30.48,27.94 0 bottom
V0-C5  30.48,25.4 0 bottom
V0-R1  26.04,33.02 0 bottom
V0-R2  26.04,30.48 0 bottom
V0-R3  21.59,30.48 0 bottom
V0-R4  21.59,33.02 0 bottom
V1-C1  35.56,25.4 180 bottom
V1-C2  40.01,30.48 180 bottom
V1-C3  35.56,27.94 180 bottom
V1-C4  35.56,30.48 180 bottom
V1-C5  35.56,33.02 180 bottom
V1-R1  40.01,25.4 180 bottom
V1-R2  40.01,27.94 180 bottom
V1-R3  44.45,27.94 180 bottom
V1-R4  44.45,25.4 180 bottom
VCC  57.15,5.08 180 top
W0-C1  30.48,44.45 0 bottom
W0-C2  26.03,39.37 0 bottom
W0-C3  30.48,41.91 0 bottom
W0-C4  30.48,39.37 0 bottom
W0-C5  30.48,36.83 0 bottom
W0-R1  26.04,44.45 0 bottom
W0-R2  26.04,41.91 0 bottom
W0-R3  21.59,41.91 0 bottom
W0-R4  21.59,44.45 0 bottom
W1-C1  35.56,36.83 180 bottom
W1-C2  40.01,41.91 180 bottom
W1-C3  35.56,39.37 180 bottom
W1-C4  35.56,41.91 180 bottom
W1-C5  35.56,44.45 180 bottom
W1-R1  40.01,36.83 180 bottom
W1-R2  40.01,39.37 180 bottom
W1-R3  44.45,39.37 180 bottom
W1-R4  44.45,36.83 180 bottom
X1  0.52,0.84 0 top

### Tracks (layer width: path | path; a pad name or v marks a point on that pad's centre or on a via)
3.3V  (via drill 0.35)
  Top 0.305: v60.96,18.41 HALL1.6 | HALL0.6 3.1,11.51 v2.54,12.06 | SPI_CONN0.5 6.54,41.72 6.67,41.59 6.67,33.97 6.03,33.34 2.22,33.34 1.91,33.02 1.91,21.59 v3.81,19.68 | v63.82,40.64 63.82,43.37 62.55,44.64 SPI_CONN1.5 59.82,44.64 59.37,45.09 59.37,48.9 59.05,49.21 55.88,49.21 54.61,47.94 54.61,47.31 54.29,46.99 46.04,46.99 45.72,47.31 I2C_1_IMU.4 | VCC.2 54.61,7.62 55.24,8.26 v60.33,8.26
  Bottom 0.305: v60.33,8.26 62.23,8.26 62.45,8.47 H1-R3.2 H1-R1.2 | H1-R1.2 62.45,18.1 62.13,18.41 v60.96,18.41 63.82,21.27 v63.82,40.64 | 3.6,12.06 H0-R1.2 3.6,10.38 7.62,6.35 7.62,2.54 53.34,2.54 54.61,3.81 VCC.2 | v2.54,12.06 3.6,12.06 | v3.81,19.68 3.81,17.04 H0-R3.2 H0-R2.2 3.6,12.06 | H1-R2.2 H1-R1.2
GND  (via drill 0.35)
  Top 0.305: IC2_0_PC.3 17.78,49.53 17.14,50.16 15.56,50.16 15.24,50.48 15.24,53.34 14.17,54.41 | 14.17,54.41 X1.6 | 17.14,44.45 17.14,44.58 HB-W0.1 | 14.17,54.41 X1.6
  Top 0.813: 17.14,44.45 16.51,44.45 | v18.41,33.97 HB-V0.1 13.34,33.02 10.79,30.48 v8.89,30.48 | v47.94,35.88 48.58,36.51 HB-W1.1 | HB-W0.1 v18.41,45.4 | v47.62,24.45 HB-V1.1 50.8,25.4 53.34,27.94 v59.37,27.94 | HB-U0.1 v18.41,22.54 | HB-U1.1 v47.62,13.02 | HALL1.1 v60.96,9.53 | SERVO_0.1 SERVO_1.1 8.89,3.49 9.84,2.54 19.68,2.54 22.23,5.08 U1.2 | SPI_CONN0.6 v5.08,34.29 | HALL0.1 v5.08,24.77 | v63.5,45.09 62.95,45.64 SPI_CONN1.6 60.64,45.96 60.64,49.21 59.69,50.16 55.24,50.16 I2C_1_IMU.1
  Bottom 0.305: U0-R2.1 U0-C2.1 26.89,20.32 | U0-C3.1 33.02,19.05 U1-C4.1 | U0-R1.1 26.89,20.32 | 26.89,20.32 33.02,20.32 | U0-C4.1 33.02,16.51 U1-C3.1 | U0-C1.1 33.02,21.59 | V0-C4.1 33.02,27.94 V1-C3.1 | V0-C3.1 33.02,30.48 V1-C4.1 | V0-C1.1 33.02,33.02 | 33.02,31.75 26.89,31.75 V0-R1.1 V0-R2.1 V0-C2.1 | W0-C1.1 33.02,44.45 | W0-C3.1 33.02,41.91 W1-C4.1 | W0-C4.1 33.02,39.37 W1-C3.1 | U1-C1.1 33.02,13.97 | 33.02,15.24 39.16,15.24 U1-R1.1 U1-R2.1 U1-C2.1 | 33.02,26.67 39.16,26.67 V1-R1.1 V1-R2.1 V1-C2.1 | V1-C1.1 33.02,25.4 | 33.02,38.1 39.16,38.1 W1-R1.1 W1-R2.1 W1-C2.1 | W1-C1.1 33.02,36.83 | 33.02,43.18 26.89,43.18 W0-R1.1 W0-R2.1 W0-C2.1
  Bottom 0.813: 33.02,34.92 33.02,36.83 33.02,38.1 33.02,39.37 33.02,41.91 33.02,43.18 33.02,44.45 33.02,46.35 19.37,46.35 v18.41,45.4 17.78,46.04 IC2_0_PC.3 | v18.41,33.97 19.37,34.92 33.02,34.92 | 33.02,34.92 46.99,34.92 v47.94,35.88 | v47.62,24.45 46.67,23.5 33.02,23.5 19.37,23.5 v18.41,22.54 | v47.62,13.02 46.67,12.06 33.02,12.06 | v5.08,34.29 v8.89,30.48 8.89,28.57 v5.08,24.77 | v59.37,27.94 60.4,28.97 60.4,37.54 62.55,39.69 62.55,44.13 v63.5,45.09 | v60.96,9.53 57.78,9.53 57.15,8.89 VCC.1
  Bottom 1.27: 33.02,34.92 33.02,33.02 33.02,31.75 33.02,30.48 33.02,27.94 33.02,26.67 33.02,25.4 33.02,23.5 33.02,21.59 33.02,20.32 33.02,19.05 33.02,16.51 33.02,15.24 33.02,13.97 33.02,12.06 33.02,7.62 | 33.02,7.62 30.48,7.62 BATTERY.1 22.86,5.08 22.23,5.71 U1.2 | 33.02,7.62 35.56,7.62 | 35.56,7.62 C0.- 57.15,7.62 VCC.1 | BATTERY.3 35.56,7.62
HALL_U0  (via drill 0.35)
  Top 0.305: HALL0.4 6.17,13.51 6.99,12.7 v6.99,11.43 MOTOR0_SENS.1
  Bottom 0.305: H0-R1.1 6.35,10.79 v6.99,11.43
HALL_U1  (via drill 0.35)
  Top 0.305: HALL1.4 59.71,14.43 v59.53,14.61 58.58,14.61 57.94,15.24 56.2,15.24 55.88,14.92 55.88,12.7 MOTOR1_SENS.1
  Bottom 0.305: v59.53,14.61 59.53,16.51 H1-R1.1
HALL_V0  (via drill 0.35)
  Top 0.305: HALL0.3 6.45,14.51 v6.99,13.97 MOTOR0_SENS.2
  Bottom 0.305: H0-R2.1 v6.99,13.97
HALL_V1  (via drill 0.35)
  Top 0.305: HALL1.3 60.87,13.34 v59.53,13.34 57.78,13.34 MOTOR1_SENS.2
  Bottom 0.305: v59.53,13.34 60.17,13.97 H1-R2.1
HALL_W0  (via drill 0.35)
  Top 0.305: HALL0.2 5.99,15.51 v6.99,16.51
  Bottom 0.305: H0-R3.1 6.67,16.83 v6.99,16.51 MOTOR0_SENS.3
HALL_W1  (via drill 0.35)
  Top 0.305: HALL1.2 59.9,12.43 v59.53,12.06
  Bottom 0.305: H1-R3.1 60.11,12.06 v59.53,12.06 59.05,12.06 58.55,12.57 58.55,15.91 57.96,16.51 MOTOR1_SENS.3
HB_IN_U0  (via drill 0.35)  (1 unrouted)
  Top 0.305: HB-U0.2 v20,20.32
  Bottom 0.305: 22.44,21.49 21.27,20.32 v20,20.32
HB_IN_U1  (via drill 0.35)
  Top 0.305: HB-U1.2 v45.72,15.24
  Bottom 0.305: v45.72,15.24 44.77,15.24 44.5,14.97 44.5,14.96 43.6,14.06 U1-R4.1
HB_IN_V0  (via drill 0.35)
  Top 0.305: HB-V0.2 v20.32,31.75
  Bottom 0.305: V0-R4.1 21.17,31.75 v20.32,31.75
HB_IN_V1  (via drill 0.35)
  Top 0.305: HB-V1.2 v45.72,26.67
  Bottom 0.305: v45.72,26.67 44.77,26.67 44.5,26.4 44.5,26.39 43.6,25.49 V1-R4.1
HB_IN_W0  (via drill 0.35)
  Top 0.305: HB-W0.2 v20.32,43.18
  Bottom 0.305: W0-R4.1 21.17,43.18 v20.32,43.18
HB_IN_W1  (via drill 0.35)
  Top 0.305: HB-W1.2 v45.72,38.1
  Bottom 0.305: v45.72,38.1 44.77,38.1 43.6,36.93 W1-R4.1
HB_INH_U0  (via drill 0.35)
  Top 0.305: v22.23,20.31 20.97,19.05 HB-U0.3
  Bottom 0.305: U0-R3.1 22.44,20.11 v22.23,20.31 v22.23,20.32
HB_INH_U1  (via drill 0.35)
  Top 0.305: HB-U1.3 45.09,16.51 v43.81,15.24
  Bottom 0.305: v43.81,15.24 43.6,15.46 U1-R3.1
HB_INH_V0  (via drill 0.35)
  Top 0.305: v22.23,31.75 20.95,30.48 HB-V0.3
  Bottom 0.305: V0-R3.1 22.44,31.54 v22.23,31.75
HB_INH_V1  (via drill 0.35)
  Top 0.305: HB-V1.3 45.09,27.94 v43.81,26.67
  Bottom 0.305: v43.81,26.67 43.6,26.89 V1-R3.1
HB_INH_W0  (via drill 0.35)
  Top 0.305: v22.23,43.18 20.95,41.91 HB-W0.3
  Bottom 0.305: W0-R3.1 22.44,42.97 v22.23,43.18
HB_INH_W1  (via drill 0.35)
  Top 0.305: HB-W1.3 45.09,39.37 v43.81,38.1 v43.81,38.11
  Bottom 0.305: v43.81,38.11 43.6,38.31 W1-R3.1
I2C0_SCL
  Top 0.305: IC2_0_PC.2 13.97,49.53 X1.5
I2C0_SDA
  Top 0.305: IC2_0_PC.1 11.43,49.53 X1.3
I2C1_SCL
  Top 0.305: 50.8,48.9 I2C_1_IMU.2 50.8,50.16 49.21,50.16 48.18,51.2 48.18,52.56 47.41,53.34 42.23,53.34 41.91,53.66 X1.28
I2C1_SDA
  Top 0.305: I2C_1_IMU.3 48.26,49.85 47.94,50.16 42.86,50.16 41.91,51.12 X1.27
IN_U0  (via drill 0.35)
  Top 0.305: v15.88,23.5 v12.7,26.67 | MOTOR0_CONTROL.4 v13.02,41.91
  Bottom 0.305: U0-R4.2 16.51,21.59 15.88,22.23 v15.88,23.5 | v13.02,41.91 13.02,26.99 v12.7,26.67
IN_U1  (via drill 0.35)
  Top 0.305: v53.98,19.37 v53.98,26.04
  Bottom 0.305: U1-R4.2 52.07,13.97 53.98,15.88 v53.98,19.37 | v53.98,26.04 53.98,27.62 58.74,32.38 58.74,40.32 MOTOR1_CONTROL.4
IN_V0  (via drill 0.35)
  Top 0.305: v15.88,34.92 13.97,36.83 v12.06,36.83
  Bottom 0.305: V0-R4.2 16.51,33.02 15.88,33.66 v15.88,34.92 | v12.06,36.83 12.05,36.82 10.79,36.82 10.75,36.87 10.75,42.59 MOTOR0_CONTROL.5
IN_V1  (via drill 0.35)
  Top 0.305: v50.8,34.29 v52.7,34.29
  Bottom 0.305: V1-R4.2 45.89,25.99 46,25.99 49.53,29.51 49.53,33.66 50.16,34.29 v50.8,34.29 | v52.7,34.29 52.7,40.01 MOTOR1_CONTROL.5
IN_W0
  Bottom 0.305: MOTOR0_CONTROL.6 12.7,46.99 15.24,44.45 W0-R4.2
IN_W1
  Bottom 0.305: W1-R4.2 47.31,36.83 49.53,39.05 49.53,43.5 50.16,44.13 54.29,44.13 MOTOR1_CONTROL.6
INH_U0  (via drill 0.35)
  Top 0.305: v14.61,23.5 v11.43,26.67
  Bottom 0.305: MOTOR0_CONTROL.1 11.43,31.75 v11.43,26.67 | v14.61,23.5 14.61,19.68 15.24,19.05 U0-R3.2
INH_U1  (via drill 0.35)
  Top 0.305: v52.7,25.4 v52.7,19.05
  Bottom 0.305: MOTOR1_CONTROL.1 57.15,33.97 52.7,29.53 v52.7,25.4 | v52.7,19.05 52.7,16.51 U1-R3.2
INH_V0  (via drill 0.35)
  Top 0.305: v14.61,34.92 v12.06,34.92
  Bottom 0.305: MOTOR0_CONTROL.2 10.79,34.92 v12.06,34.92 | V0-R3.2 15.24,30.48 14.61,31.11 v14.61,34.92
INH_V1  (via drill 0.35)
  Top 0.305: v50.8,35.56 v53.98,35.56
  Bottom 0.305: V1-R3.2 48.9,31.54 48.9,34.61 49.85,35.56 v50.8,35.56 | v53.98,35.56 55.24,36.83 MOTOR1_CONTROL.2
INH_W0  (via drill 0.35)
  Top 0.305: MOTOR0_CONTROL.3 10.16,40.64 v12.06,40.64
  Bottom 0.305: v12.06,40.64 12.06,42.86 13.65,42.86 14.61,41.91 W0-R3.2
INH_W1  (via drill 0.35)
  Top 0.305: v51.75,45.09 51.75,43.18 55.56,39.37 MOTOR1_CONTROL.3
  Bottom 0.305: W1-R3.2 48.26,39.37 48.58,39.69 48.58,44.77 48.9,45.09 v51.75,45.09
IS_U0  (via drill 0.35)
  Top 0.305: v22.23,16.51 20.95,15.24 HB-U0.6 v15.24,15.24
  Bottom 0.305: v22.23,16.51 23.5,16.51 23.81,16.83 23.81,21.27 24.13,21.59 U0-R1.2 25.18,22.49 25.32,22.62 28.18,22.62 28.26,22.54 28.26,21.91 28.57,21.59 U0-C1.2 | MOTOR0_SENS.4 10.79,19.05 14.61,15.24 v15.24,15.24
IS_U1  (via drill 0.35)
  Top 0.305: v43.81,19.05 45.09,20.32 HB-U1.6 v50.8,20.32
  Bottom 0.305: v43.81,19.05 42.7,19.05 42.23,18.57 42.23,14.29 41.91,13.97 U1-R1.2 40.85,13.07 40.64,12.86 38.1,12.86 37.78,13.18 37.78,13.65 37.47,13.97 U1-C1.2 | MOTOR1_SENS.4 55.88,20.32 v50.8,20.32
IS_V0  (via drill 0.35)
  Top 0.305: v22.23,27.94 20.95,26.67 HB-V0.6 v15.24,26.67
  Bottom 0.305: V0-C1.2 28.57,33.02 28.26,33.34 28.26,33.97 28.18,34.05 25.24,34.05 25.18,34 V0-R1.2 24.13,33.02 23.81,32.7 23.81,28.26 23.5,27.94 v22.23,27.94 | MOTOR0_SENS.5 10.16,21.59 v15.24,26.67
IS_V1  (via drill 0.35)
  Top 0.305: v43.81,30.48 45.09,31.75 HB-V1.6 v50.8,31.75
  Bottom 0.305: v43.81,30.48 42.55,30.48 42.23,30.16 42.23,25.72 41.91,25.4 V1-R1.2 40.85,24.5 40.64,24.29 38.1,24.29 37.78,24.61 37.78,25.08 37.47,25.4 V1-C1.2 | MOTOR1_SENS.5 50.8,21.59 v50.8,31.75
IS_W0  (via drill 0.35)
  Top 0.305: v22.23,39.37 20.95,38.1 HB-W0.6 v15.24,38.1
  Bottom 0.305: v22.23,39.37 23.5,39.37 23.81,39.69 23.81,44.13 24.13,44.45 W0-R1.2 25.18,45.43 25.24,45.48 28.02,45.48 28.26,45.24 28.26,44.77 28.57,44.45 W0-C1.2 | MOTOR0_SENS.6 11.75,24.13 13.65,26.04 13.65,38.1 v15.24,38.1
IS_W1  (via drill 0.35)
  Top 0.305: v43.81,41.91 45.09,43.18 HB-W1.6 v50.8,43.18
  Bottom 0.305: v43.81,41.91 42.55,41.91 42.23,41.59 42.23,37.15 41.91,36.83 W1-R1.2 40.85,36.01 40.64,35.8 38.02,35.8 37.78,36.04 37.78,36.51 37.47,36.83 W1-C1.2 | MOTOR1_SENS.6 55.88,22.86 52.39,22.86 51.75,23.5 51.75,43.18 v50.8,43.18
SERVO_0
  Top 0.305: SERVOS.1 SERVO_0.2
SERVO_1
  Top 0.305: SERVO_1.2 12.7,6.35 12.7,10.16 SERVOS.2
SPI_CS0  (via drill 0.35)
  Top 0.305: SPI_CONN0.1 5.08,48.26 v6.99,50.16
  Bottom 0.305: v6.99,50.16 7.62,50.8 30.48,50.8 30.48,53.02 30.8,53.34 36.51,53.34 36.83,53.66 X1.24
SPI_CS1  (via drill 0.35)
  Top 0.305: SPI_CONN1.1 60.33,40.01 v60.33,39.37
  Bottom 0.305: v60.33,39.37 60.33,50.16 58.42,52.07 58.42,52.7 57.78,53.34 40.01,53.34 39.37,53.98 X1.26
SPI_MISO  (via drill 0.35)
  Top 0.305: SPI_CONN1.4 59.55,43.64 v59.37,43.81 | SPI_CONN0.4 7.48,42.72 7.94,43.18 9.53,43.18 12.7,46.35 19.68,46.35 21.91,48.58 32.02,48.58 v32.07,48.53
  Bottom 0.305: v59.37,43.81 59.37,48.9 59.05,49.21 55.88,49.21 54.61,47.94 54.61,47.31 54.29,46.99 52.39,46.99 52.07,47.31 52.07,49.85 51.75,50.16 34.61,50.16 34.29,50.48 X1.21 34.29,50.75 v32.07,48.53
SPI_MOSI  (via drill 0.35)
  Top 0.305: SPI_CONN1.3 58.96,42.64 58.58,43.02 58.58,48.1 58.1,48.58 56.21,48.58 55.24,47.61 55.24,46.99 54.61,46.35 45.4,46.35 43.5,48.26 33.66,48.26 31.75,50.17 X1.19 | SPI_CONN0.3 6.89,43.72 v6.99,43.81
  Bottom 0.305: v6.99,43.81 7.01,43.84 7.01,48.46 8.72,50.16 31.75,50.16 X1.19
SPI_SCLK  (via drill 0.35)
  Top 0.305: SPI_CONN1.2 59.18,41.64 57.67,43.16 55.59,43.16 53.64,45.1 v53.34,45.1 | v36.83,49.21 X1.23 | v19.68,47.62 19.05,47.62 18.39,46.97 10.79,46.97 | 10.6,46.97 10.79,46.97 | 10.79,46.97 9.55,45.72 7.62,45.72 6.62,44.72 SPI_CONN0.2
  Bottom 0.305: X1.23 | v53.34,45.1 52.09,46.35 45.4,46.35 42.55,49.21 v36.83,49.21 35.24,47.62 v19.68,47.62
SR_U0  (via drill 0.35)
  Top 0.305: HB-U0.5 v20.32,16.51
  Bottom 0.305: v20.32,16.51 21.61,15.22 24.84,15.22 25.18,15.56 U0-C2.2 U0-R2.2
SR_U1  (via drill 0.35)
  Top 0.305: HB-U1.5 v45.72,19.05
  Bottom 0.305: U1-R2.2 U1-C2.2 40.85,19.9 41.27,20.32 44.45,20.32 v45.72,19.05
SR_V0  (via drill 0.35)
  Top 0.305: HB-V0.5 v20.32,27.94
  Bottom 0.305: V0-R2.2 V0-C2.2 25.18,27.09 24.77,26.67 21.59,26.67 v20.32,27.94
SR_V1  (via drill 0.35)
  Top 0.305: HB-V1.5 v45.72,30.48
  Bottom 0.305: v45.72,30.48 44.45,31.75 41.27,31.75 40.85,31.33 V1-C2.2 V1-R2.2
SR_W0  (via drill 0.35)
  Top 0.305: HB-W0.5 v20.32,39.37
  Bottom 0.305: v20.32,39.37 21.59,38.1 24.77,38.1 25.18,38.52 W0-C2.2 W0-R2.2
SR_W1  (via drill 0.35)
  Top 0.305: HB-W1.5 v45.72,41.91
  Bottom 0.305: v45.72,41.91 44.45,43.18 41.12,43.18 40.85,42.92 W1-C2.2 W1-R2.2
U0  (via drill 0.35)
  Top 0.305: HB-U0.8 23.75,13.97 v22.23,13.97
  Top 0.813: HB-U0.8 HB-U0.4 13.97,17.78 10.79,20.95 10.79,25.4 9.53,26.67 MOTOR0.1
  Bottom 0.305: U0-C3.2 28.57,19.05 28.26,18.73 28.26,13.97 | v22.23,13.97 28.26,13.97 | U0-C5.2 28.26,13.97
U1  (via drill 0.35)
  Top 0.305: HB-U1.8 38.6,17.91 42.28,21.59 v43.81,21.59
  Top 0.813: 38.6,17.91 38.73,17.78 HB-U1.4 54.61,17.78 55.24,18.41 55.24,25.4 56.52,26.67 MOTOR1.1
  Bottom 0.305: v43.81,21.59 37.78,21.59 | 37.78,21.59 U1-C5.2 | U1-C3.2 37.47,16.51 37.78,16.83 37.78,21.59
V0  (via drill 0.35)
  Top 0.305: HB-V0.8 23.75,25.4 v22.23,25.4
  Top 0.813: HB-V0.8 HB-V0.4 MOTOR0.2
  Bottom 0.305: v22.23,25.4 28.26,25.4 | 28.26,25.4 V0-C5.2 | V0-C3.2 28.57,30.48 28.26,30.16 28.26,25.4
V1  (via drill 0.35)
  Top 0.305: HB-V1.8 42.28,33.02 v43.81,33.02
  Top 0.813: HB-V1.8 HB-V1.4 MOTOR1.2
  Bottom 0.305: v43.81,33.02 37.78,33.02 | 37.78,33.02 V1-C5.2 | 37.78,33.02 37.78,28.26 37.47,27.94 V1-C3.2
VCC-SERVOS  (via drill 0.35)
  Top 0.813: v35.73,9.84 20,9.84 19.68,9.53 U1.3 SERVO_0.3 SERVO_1.3 | VCC.4 v49.53,9.84
  Bottom 0.813: v35.73,9.84 v49.53,9.84
VI  (via drill 0.35)
  Top 0.305: HB-V0.7 v20.32,25.4 | HB-U0.7 v20.32,13.97 | HB-W0.7 v20.32,36.83 | v45.72,21.59 HB-U1.7 | v45.72,33.02 HB-V1.7
  Top 0.813: 33.02,34.92 33.02,46.36 43.81,46.36 v45.72,44.45 HB-W1.7 | HB-V1.7 46.67,34.92 33.02,34.92 | 33.02,34.92 19.37,34.92 HB-W0.7 | HB-V0.7 19.37,23.5 33.02,23.5 46.67,23.5 HB-U1.7 | HB-U0.7 19.37,12.06 33.02,12.06
  Top 1.27: 33.02,34.92 33.02,23.5 33.02,12.06 33.02,11.75 38.1,11.75 38.1,7.62 | U1.1 33.02,7.62 | 33.02,7.62 38.1,7.62 | BATTERY.2 33.02,7.62 | C0.+ 38.73,5.08 38.1,5.71 38.1,7.62
  Bottom 0.305: U0-C4.2 29.63,15.46 29.84,15.24 31.11,15.24 31.33,15.03 U0-C5.1 31.33,13.23 31.11,13.02 21.27,13.02 v20.32,13.97 | v20.32,25.4 21.27,24.45 31.11,24.45 31.33,24.66 V0-C5.1 31.33,26.45 31.11,26.67 29.84,26.67 29.63,26.89 V0-C4.2 | v20.32,36.83 21.27,35.88 31.11,35.88 31.33,36.09 W0-C5.1 31.33,38.04 31.27,38.1 29.84,38.1 29.63,38.31 W0-C4.2 | v45.72,21.59 44.83,22.48 34.97,22.48 34.71,22.22 U1-C5.1 34.71,20.54 34.92,20.32 36.2,20.32 36.41,20.11 U1-C4.2 | v45.72,33.02 44.77,33.97 34.92,33.97 34.71,33.76 V1-C5.1 34.61,32.92 34.61,32.07 34.92,31.75 36.2,31.75 36.41,31.54 V1-C4.2 | v45.72,44.45 44.77,45.4 34.92,45.4 34.71,45.19 W1-C5.1 34.71,43.4 34.92,43.18 36.2,43.18 36.41,42.97 W1-C4.2
W0  (via drill 0.35)
  Top 0.305: HB-W0.8 27.43,40.51 23.75,36.83 v22.23,36.83
  Top 0.813: 27.43,40.51 27.3,40.64 HB-W0.4 13.97,40.64 10.79,37.47 10.79,33.02 9.53,31.75 MOTOR0.3
  Bottom 0.305: v22.23,36.83 28.26,36.83 | 28.26,36.83 W0-C5.2 | W0-C3.2 28.57,41.91 28.26,41.59 28.26,36.83
W1  (via drill 0.35)
  Top 0.305: HB-W1.8 42.28,44.45 v43.81,44.45
  Top 0.813: HB-W1.8 HB-W1.4 52.07,40.64 55.24,37.47 55.24,33.02 56.52,31.75 MOTOR1.3
  Bottom 0.305: v43.81,44.45 37.78,44.45 | 37.78,44.45 W1-C5.2 | 37.78,44.45 37.78,39.69 37.47,39.37 W1-C3.2

### Text on the board
tPlace: GND | CS0 | CS1 | SCL | MOSI | MISO | SCLK | SDA | SDA | SCL | IN_W0 | SDA | SCL | GND | 3.3V | SDA | SCL | GND | IN_W1 | IN_V1 | IN_V0 | GND | VS | IN | IS | IN_U0 | INH | SR | IN_U1 | OUT | OUT | INH_W1 | INH_W0 | SR | INH | IS | IN | INH_V0 | VS | GND | INH_V1 | INH_U1 | INH_U0 | GND | VS | W0 | IN | INH | IS | W1 | V0 | OUT | SR | OUT | V1 | SR | INH | U0 | IS | VS | IN | U1 | GND | IS_W0 | IS_W1 | GND | IS_V1 | IS_V0 | IN | VS | IS | IS_U0 | INH | SR | IS_U1 | OUT | SR | OUT | HALL_W1 | HALL_W0 | IS | INH | IN | HALL_V0 | VS | GND | HALL_V1 | HALL_U1 | GND | PWM | VCC | GND | 6-24V | GND | VCC | 5.0V | 3.3V | GND
bPlace: RPiMotorHat / v.2020.04